# EAGLE design RemoteControl (EAGLE 9.6.2)
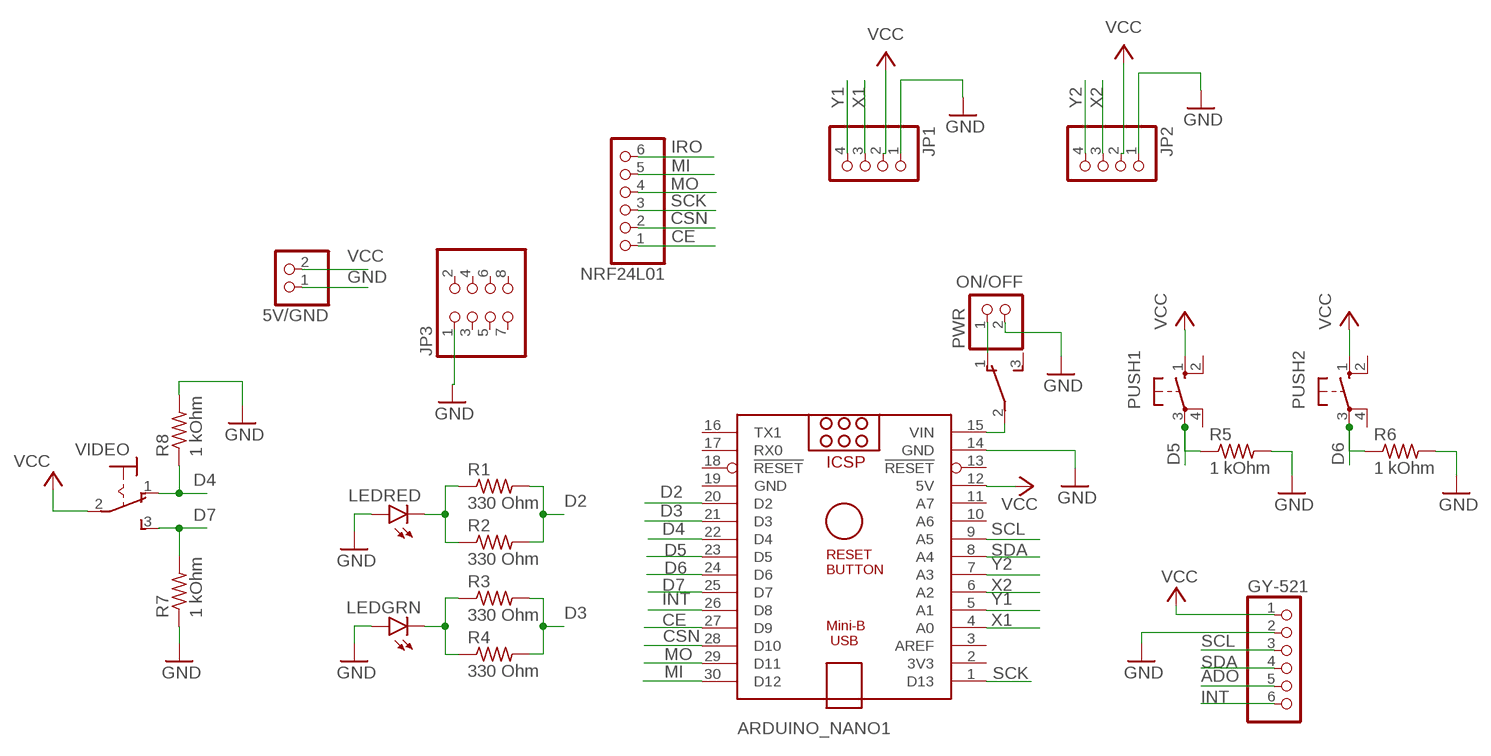
[diagram p0: schematic, sheet 1]

## Parts
5V/GND  PINHD-1X2  [1X02]
ARDUINO_NANO1  ARDUINO_NANO  [ARDUINO_NANO]
GY-521  PINHD-1X6  [1X06]
JP1  PINHD-1X4  [1X04]
JP2  PINHD-1X4  [1X04]
JP3  PINHD-2X4  [2X04]
LEDGRN  LED5MM  [LED5MM]
LEDRED  LED5MM  [LED5MM]
NRF24L01  PINHD-1X6  [1X06]
ON/OFF  TL36WO  [TL3XWO]
PUSH1  10-XX  [B3F-10XX]
PUSH2  10-XX  [B3F-10XX]
PWR  PINHD-1X2  [1X02]
R1  330 Ohm  R-US_0204/7  [0204/7]
R2  330 Ohm  R-US_0204/7  [0204/7]
R3  330 Ohm  R-US_0204/7  [0204/7]
R4  330 Ohm  R-US_0204/7  [0204/7]
R5  1 kOhm  R-US_0204/7  [0204/7]
R6  1 kOhm  R-US_0204/7  [0204/7]
R7  1 kOhm  R-US_0204/7  [0204/7]
R8  1 kOhm  R-US_0204/7  [0204/7]
VIDEO  320-916  [320-916]

## Nets
ADO: GY-521.5
CE: ARDUINO_NANO1.27(D9) NRF24L01.1
CSN: ARDUINO_NANO1.28(D10) NRF24L01.2
D2: ARDUINO_NANO1.20(D2) R1.2 R2.2
D3: ARDUINO_NANO1.21(D3) R3.2 R4.2
D4: ARDUINO_NANO1.22(D4) R8.1 VIDEO.1(O)
D5: ARDUINO_NANO1.23(D5) PUSH1.3(P) R5.1
D6: ARDUINO_NANO1.24(D6) PUSH2.3(P) R6.1
D7: ARDUINO_NANO1.25(D7) R7.2 VIDEO.3(S)
GND: 5V/GND.1 ARDUINO_NANO1.14(GND) GY-521.2 JP1.1 JP2.1 JP3.1 LEDGRN.A LEDRED.A PWR.2 R5.2 R6.2 R7.1 R8.2
INT: ARDUINO_NANO1.26(D8) GY-521.6
IRO: NRF24L01.6
MI: ARDUINO_NANO1.30(D12) NRF24L01.5
MO: ARDUINO_NANO1.29(D11) NRF24L01.4
N$1: ARDUINO_NANO1.15(VIN) ON/OFF.2(P)
N$2: ON/OFF.1(O) PWR.1
N$3: LEDRED.K(C) R1.1 R2.1
N$5: LEDGRN.K(C) R3.1 R4.1
SCK: ARDUINO_NANO1.1(D13) NRF24L01.3
SCL: ARDUINO_NANO1.9(A5) GY-521.3
SDA: ARDUINO_NANO1.8(A4) GY-521.4
VCC: 5V/GND.2 ARDUINO_NANO1.12(5V) GY-521.1 JP1.2 JP2.2 PUSH1.1(S) PUSH2.1(S) VIDEO.2(P)
X1: ARDUINO_NANO1.4(A0) JP1.3
X2: ARDUINO_NANO1.6(A2) JP2.3
Y1: ARDUINO_NANO1.5(A1) JP1.4
Y2: ARDUINO_NANO1.7(A3) JP2.4
Unconnected: ARDUINO_NANO1.2(3V3) ARDUINO_NANO1.3(AREF) ARDUINO_NANO1.10(A6) ARDUINO_NANO1.11(A7) ARDUINO_NANO1.13(!RESET) ARDUINO_NANO1.16(TX1) ARDUINO_NANO1.17(RX0) ARDUINO_NANO1.18(!RESET) JP3.2 JP3.3 JP3.4 JP3.5 JP3.6 JP3.7 JP3.8 ON/OFF.3(S) PUSH1.2(S1) PUSH1.4(P1) PUSH2.2(S1) PUSH2.4(P1)

## Power pins joined to a net without a drawn wire
GND: ARDUINO_NANO1.19(GND)

## Library data of the parts
5V/GND PWR = pinhead:PINHD-1X2: PIN HEADER
ARDUINO_NANO1 = ArduinoNanoV30:ARDUINO_NANO: Arduino Nano V3.0 Overview: The Arduino Nano is a small, complete, and breadboard-friendly board based on the ATmega328 (Arduino Nano 3.x) or ATmega168 (Arduino Nano 2.x). It has more or less the same functionality of the Arduino Duemilanove, but in a different package. It lacks only a DC power jack, and works with a Mini-B USB cable instead of a standard one. The Nano was designed and is being produced by Gravitech. Specifications: Microcontroller Atmel ATmega168 or ATmega328 Operating Voltage (logic level) 5 V Input Voltage (recommended) 7-12 V Input Voltage (limits) 6-20 V Digital I/O Pins 14 (of which 6 provide PWM output) Analog Input Pins 8 DC Current per I/O Pin 40 mA Flash Memory 16 KB (ATmega168) or 32 KB (ATmega328) of which 2 KB used by bootloader SRAM 1 KB (ATmega168) or 2 KB (ATmega328) EEPROM 512 bytes (ATmega168) or 1 KB (ATmega328) Clock Speed 16 MHz Dimensions 0.73" x 1.70" Length 45 mm Width 18 mm Weigth 5 g Power: The Arduino Nano can be powered via the Mini-B USB connection, 6-20V unregulated external power supply (pin 30), or 5V regulated external power supply (pin 27). The power source is automatically selected to the highest voltage source. Memory: The ATmega168 has 16 KB of flash memory for storing code (of which 2 KB is used for the bootloader); the ATmega328 has 32 KB, (also with 2 KB used for the bootloader). The ATmega168 has 1 KB of SRAM and 512 bytes of EEPROM (which can be read and written with the EEPROM library); the ATmega328 has 2 KB of SRAM and 1 KB of EEPROM. Input and Output: Each of the 14 digital pins on the Nano can be used as an input or output, using pinMode(), digitalWrite(), and digitalRead() functions. They operate at 5 volts. Each pin can provide or receive a maximum of 40 mA and has an internal pull-up resistor (disconnected by default) of 20-50 kOhms. In addition, some pins have specialized functions. Visit Arduino - ArduinoBoardNano <https://www.arduino.cc/en/Main/ArduinoBoardNano>
GY-521 NRF24L01 = pinhead:PINHD-1X6: PIN HEADER
JP1 JP2 = pinhead:PINHD-1X4: PIN HEADER
JP3 = pinhead:PINHD-2X4: PIN HEADER
LEDGRN LEDRED = led:LED: LED OSRAM: - CHIPLED LG R971, LG N971, LY N971, LG Q971, LY Q971, LO R971, LY R971 LH N974, LH R974 LS Q976, LO Q976, LY Q976 LO Q996 - Hyper CHIPLED LW Q18S LB Q993, LB Q99A, LB R99A - SideLED LS A670, LO A670, LY A670, LG A670, LP A670 LB A673, LV A673, LT A673, LW A673 LH A674 LY A675 LS A676, LA A676, LO A676, LY A676, LW A676 LS A679, LY A679, LG A679 - Hyper Micro SIDELED® LS Y876, LA Y876, LO Y876, LY Y876 LT Y87S - SmartLED LW L88C, LW L88S LB L89C, LB L89S, LG L890 LS L89K, LO L89K, LY L89K LS L896, LA L896, LO L896, LY L896 - TOPLED LS T670, LO T670, LY T670, LG T670, LP T670 LSG T670, LSP T670, LSY T670, LOP T670, LYG T670 LG T671, LOG T671, LSG T671 LB T673, LV T673, LT T673, LW T673 LH T674 LS T676, LA T676, LO T676, LY T676, LB T676, LH T676, LSB T676, LW T676 LB T67C, LV T67C, LT T67C, LS T67K, LO T67K, LY T67K, LW E67C LS E67B, LA E67B, LO E67B, LY E67B, LB E67C, LV E67C, LT E67C LW T67C LS T679, LY T679, LG T679 LS T770, LO T770, LY T770, LG T770, LP T770 LB T773, LV T773, LT T773, LW T773 LH T774 LS E675, LA E675, LY E675, LS T675 LS T776, LA T776, LO T776, LY T776, LB T776 LHGB T686 LT T68C, LB T68C - Hyper Mini TOPLED® LB M676 - Mini TOPLED Santana® LG M470 LS M47K, LO M47K, LY M47K Source: http://www.osram.convergy.de LUXEON: - LUMILED® LXK2-PW12-R00, LXK2-PW12-S00, LXK2-PW14-U00, LXK2-PW14-V00 LXK2-PM12-R00, LXK2-PM12-S00, LXK2-PM14-U00 LXK2-PE12-Q00, LXK2-PE12-R00, LXK2-PE12-S00, LXK2-PE14-T00, LXK2-PE14-U00 LXK2-PB12-K00, LXK2-PB12-L00, LXK2-PB12-M00, LXK2-PB14-N00, LXK2-PB14-P00, LXK2-PB14-Q00 LXK2-PR12-L00, LXK2-PR12-M00, LXK2-PR14-Q00, LXK2-PR14-R00 LXK2-PD12-Q00, LXK2-PD12-R00, LXK2-PD12-S00 LXK2-PH12-R00, LXK2-PH12-S00 LXK2-PL12-P00, LXK2-PL12-Q00, LXK2-PL12-R00 Source: www.luxeon.com KINGBRIGHT: KA-3528ASYC Source: www.kingbright.com
ON/OFF = switch_TL3XWO:TL36WO: TINY SWITCH ON - ON Source: http://www2.produktinfo.conrad.com/datenblaetter/700000-724999/705152-da-01-de-Subminiaturschalter_TL_36WO.pdf
PUSH1 PUSH2 = switch-omron:10-XX: OMRON SWITCH; MPN: B3F-1000; OC_FARNELL: 176432; OC_NEWARK: 36M3542
R1-R8 = rcl:R-US_: RESISTOR, American symbol; SPICEPREFIX: R
VIDEO = switch:320-916: TOGGLE SWITCH distributor RS Components

## Board
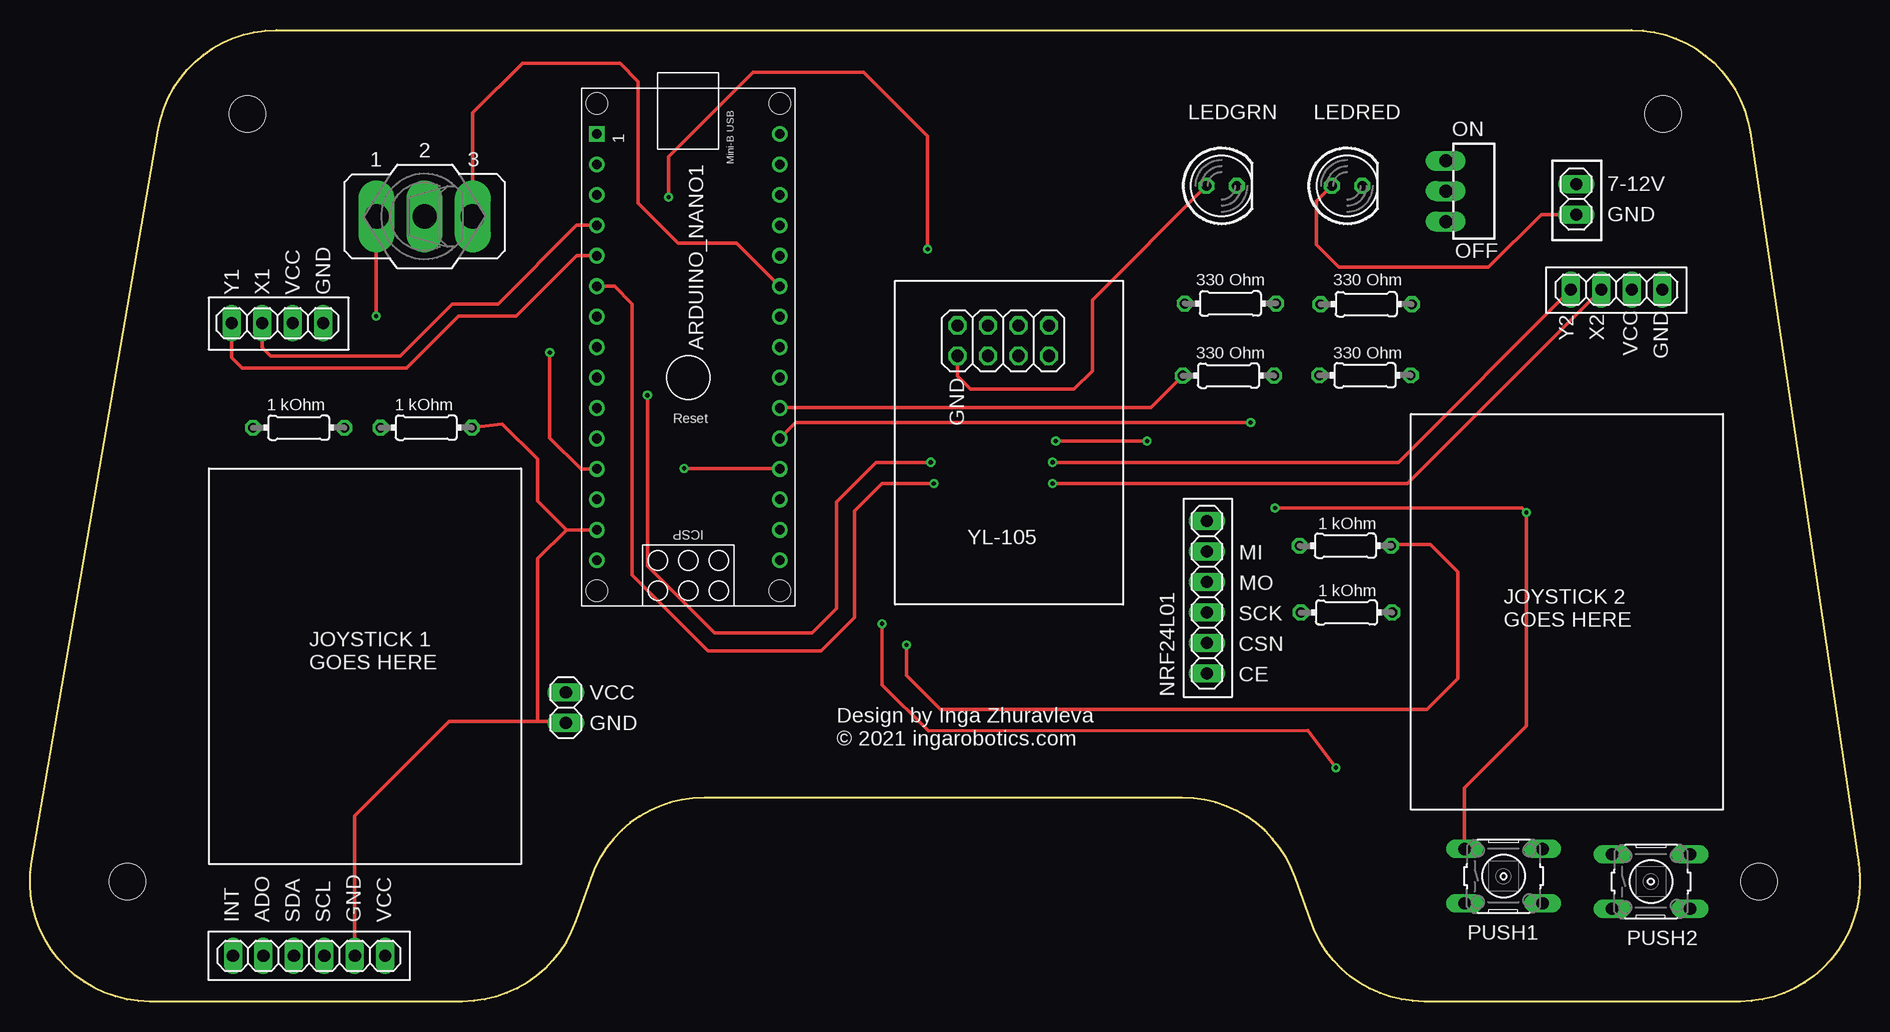
[diagram p1: board, top side]
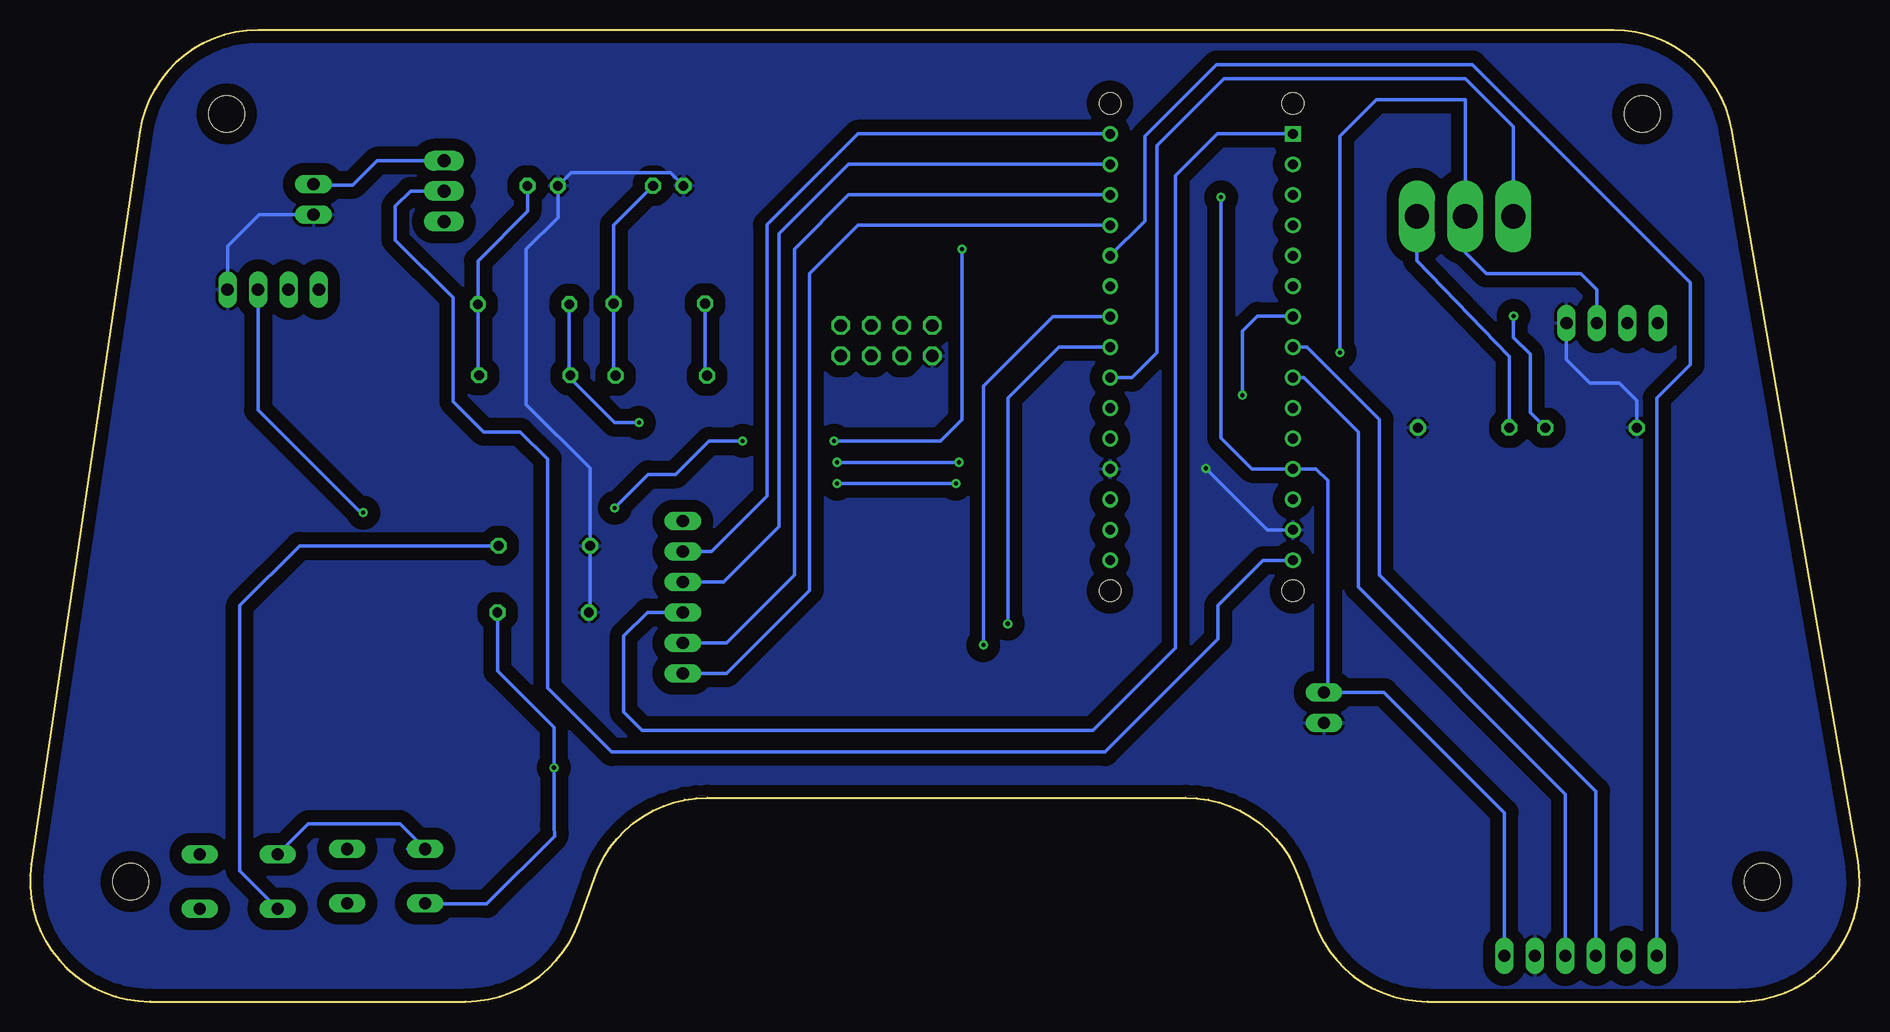
[diagram p2: board, bottom side, seen from below]

Size 152.52 x 81 mm. Coordinates in mm from the lower left corner, seen from the top.
Outline: 0.14,11.7 10.69,72.7 arc-80 20.54,81 133.49,81 arc-82 143.38,72.47 152.42,11.46 arc-98 142.53,0 116.2,0 arc-71 106.77,6.67 105.48,10.33 arc71 96.05,17 56.2,17 arc71 46.77,10.33 45.48,6.67 arc-71 36.05,0 10,0 arc-100 0.14,11.7
Copper layers (1*16): Top 0.035mm / dielectric 1.5mm / Bottom 0.035mm
Design rules "default": minimum track width 6mil, minimum drill 0.35mm, track to track 6mil, track to pad 6mil, pad to pad 6mil, via to via 6mil, smd to smd 6mil, copper to edge 40mil, drill to drill 6mil, minimum pad ring 10mil, minimum via ring 8mil, stop-mask expansion 4mil, vias tented up to drill 0mil, thermal gap 10mil
Holes 3 mm at 18.12,74 136.12,74 8.12,10 144.12,10

### Footprints (pad centres in the part's own frame; a part is rotated, then mirrored left to right if it is on the bottom)
1X02 = drill 1.016 long: 1 -1.27,0; 2 1.27,0
ARDUINO_NANO = drill 0.8 square: 1 -20.32,-7.62 | drill 0.8: 2 -17.78,-7.62; 3 -15.24,-7.62; 4 -12.7,-7.62; 5 -10.16,-7.62; 6 -7.62,-7.62; 7 -5.08,-7.62; 8 -2.54,-7.62; 9 0,-7.62; 10 2.54,-7.62; 11 5.08,-7.62; 12 7.62,-7.62; 13 10.16,-7.62; 14 12.7,-7.62; 15 15.24,-7.62; 16 15.24,7.62; 17 12.7,7.62; 18 10.16,7.62; 19 7.62,7.62; 20 5.08,7.62; 21 2.54,7.62; 22 0,7.62; 23 -2.54,7.62; 24 -5.08,7.62; 25 -7.62,7.62; 26 -10.16,7.62; 27 -12.7,7.62; 28 -15.24,7.62; 29 -17.78,7.62; 30 -20.32,7.62 | hole 1.778: -22.86,-7.62; -22.86,7.62; 17.78,7.62; 17.78,-7.62
1X06 = drill 1.016 long: 1 -6.35,0; 2 -3.81,0; 3 -1.27,0; 4 1.27,0; 5 3.81,0; 6 6.35,0
1X04 = drill 1.016 long: 1 -3.81,0; 2 -1.27,0; 3 1.27,0; 4 3.81,0
2X04 = drill 1.016 octagon: 1 -3.81,-1.27; 2 -3.81,1.27; 3 -1.27,-1.27; 4 -1.27,1.27; 5 1.27,-1.27; 6 1.27,1.27; 7 3.81,-1.27; 8 3.81,1.27
LED5MM = drill 0.813 octagon: A -1.27,0; K 1.27,0
TL3XWO = drill 1.1 pad 1.422 long: 1 -2.54,-5.08; 2 0,-5.08; 3 2.54,-5.08
B3F-10XX = drill 1.016 long: 1 -3.251,2.261; 2 3.251,2.261; 3 -3.251,-2.261; 4 3.251,-2.261
0204/7 = drill 0.813 octagon: 1 -3.81,0; 2 3.81,0
320-916 = drill 2.007 long: 1 0,4.013; 2 0,0; 3 0,-4.013

### Placement (x,y rotation side)
5V/GND  44.66,24.51 90 top
ARDUINO_NANO1  54.87,52.02 270 top
GY-521  23.27,3.81 180 top
JP1  20.63,56.55 180 top
JP2  132.25,59.35 180 top
JP3  81.12,55.1 0 top
LEDGRN  99.32,68.01 0 top
LEDRED  109.78,68.01 0 top
NRF24L01  98.1,33.71 90 top
ON/OFF  123.09,67.56 270 top
PUSH1  122.83,10.45 0 top
PUSH2  135.12,10 0 top
PWR  128.89,66.88 270 top
R1  111.38,58.13 180 top
R2  111.28,52.21 180 top
R3  99.9,52.18 180 top
R4  100.06,58.2 180 top
R5  109.74,32.44 180 top
R6  109.64,38 180 top
R7  33.02,47.84 180 top
R8  22.4,47.84 180 top
VIDEO  32.89,65.46 90 top

### Tracks (layer width: path | path; a pad name or v marks a point on that pad's centre or on a via)
CE
  Bottom 0.305: ARDUINO_NANO1.27 83.51,64.72 87.53,60.71 87.53,34.29 94.45,27.36 NRF24L01.1
CSN
  Bottom 0.305: ARDUINO_NANO1.28 84.28,67.26 88.8,62.74 88.8,35.56 94.45,29.9 NRF24L01.2
D2  (via drill 0.35)
  Top 0.305: ARDUINO_NANO1.20 63.81,48.26 v101.75,48.26
  Bottom 0.305: R1.2 107.57,52.31 R2.2 107.47,51.96 103.77,48.26 v101.75,48.26
D3
  Top 0.305: R3.2 93.44,49.53 62.79,49.53 62.74,49.48 ARDUINO_NANO1.21
  Bottom 0.305: R4.2 96.25,52.34 R3.2
D4  (via drill 0.35)
  Top 0.305: v28.85,57.15 28.85,65.43 VIDEO.1
  Bottom 0.305: VIDEO.1 28.88,72.92 32.89,76.94 53.01,76.94 58.57,71.37 58.57,54.1 60.65,52.02 ARDUINO_NANO1.22 | v28.85,57.15 28.85,55.37 27.48,54 27.48,49.11 R8.1
D5  (via drill 0.35)
  Top 0.305: v71.02,31.5 71.02,26.42 74.89,22.54 106.51,22.62 v108.85,19.49
  Bottom 0.305: ARDUINO_NANO1.23 66.75,54.56 71.02,50.29 v71.02,31.5 | R5.1 113.55,27.55 108.85,22.84 v108.85,19.49 108.85,14.69 108.8,13.78 114.45,8.13 119.52,8.13 PUSH1.3
D6  (via drill 0.35)
  Top 0.305: v73.05,29.72 73.05,27.18 75.89,24.34 116.44,24.34 119.02,26.92 119.02,35.81 116.74,38.1 113.55,38.1 R6.1
  Bottom 0.305: PUSH2.3 135.03,10.9 135.03,33.02 130.05,38 R6.1 | ARDUINO_NANO1.24 67.26,57.1 73.05,51.31 v73.05,29.72
D7
  Top 0.305: ARDUINO_NANO1.25 58.88,63.25 54,63.25 50.7,66.55 50.7,76.71 49.17,78.23 41.05,78.23 36.91,74.09 VIDEO.3
  Bottom 0.305: 36.83,65.39 VIDEO.3 36.91,61.78 29.21,53.76 R7.2
GND  (via drill 0.35)
  Top 0.305: R7.1 39.37,48.15 42.32,45.21 42.32,41.71 44.71,39.32 | 44.71,39.32 ARDUINO_NANO1.14 | LEDGRN.A 88.54,58.5 88.54,52.58 87.02,51.05 78.38,51.05 77.31,52.13 JP3.1 | GY-521.2 27.08,15.49 34.95,23.37 42.32,23.37 | 42.32,23.37 44.53,23.37 5V/GND.1 | 44.71,39.32 42.32,36.93 42.32,23.37 | PWR.2 125.96,65.61 121.56,61.21 109.12,61.21 107.24,63.09 107.24,66.74 LEDRED.A | v54.51,44.45 62.44,44.45 ARDUINO_NANO1.19
  Bottom 0.305: LEDGRN.A 99.13,69.09 107.43,69.09 LEDRED.A 108.51,65.37 111.15,62.74 111.15,49.78 105.83,44.47 R6.2 105.83,32.54 R5.2 | R8.2 18.59,50.12 20.03,51.56 22.5,51.56 24.44,53.5 JP1.1 | PWR.2 133.42,65.61 136.06,62.98 JP2.1 | ARDUINO_NANO1.14 49.38,39.32 v54.51,44.45
  pour Bottom (isolate 1.016): -8.23,84.84 160.93,84.84 160.93,-3.56 -8.23,-3.56
INT
  Bottom 0.305: ARDUINO_NANO1.26 59.59,65.08 59.59,72.14 53.62,78.11 32.28,78.11 14.12,59.94 14.12,53.09 16.92,50.29 GY-521.6
MI
  Bottom 0.305: ARDUINO_NANO1.30 83.51,72.34 91.08,64.77 91.08,42.16 95.72,37.52 NRF24L01.5
MO
  Bottom 0.305: ARDUINO_NANO1.29 84.28,69.8 90.07,64.01 90.07,39.62 94.71,34.98 NRF24L01.4
N$1
  Bottom 0.305: ARDUINO_NANO1.15 49.73,36.78 53.49,33.02 53.49,30.23 62.91,20.81 104.02,20.81 109.37,26.16 109.37,45.21 111.66,47.5 114.71,47.5 117.25,50.04 117.25,58.67 122.07,63.5 122.07,66.29 120.8,67.56 ON/OFF.2
N$2
  Bottom 0.305: ON/OFF.1 123.6,70.1 125.63,68.07 128.81,68.07 PWR.1
N$3
  Bottom 0.305: R2.1 115.19,52.31 R1.1 115.19,61.75 111.05,65.88 LEDRED.K
N$5
  Bottom 0.305: LEDGRN.K 103.87,64.73 R4.1 103.87,52.34 R3.1
SCK
  Bottom 0.305: ARDUINO_NANO1.1 53.54,72.34 57.05,68.83 57.05,29.46 63.91,22.61 101.5,22.61 103.02,24.13 103.02,30.48 101.06,32.44 NRF24L01.3
SCL
  Bottom 0.305: ARDUINO_NANO1.9 46.33,52.02 41.81,47.5 41.81,34.54 24.54,17.27 GY-521.3
SDA
  Bottom 0.305: ARDUINO_NANO1.8 46.08,54.56 40.03,48.51 40.03,35.56 22,17.53 GY-521.4
VCC  (via drill 0.35)
  Top 0.305: v43.33,54.1 43.33,46.99 45.92,44.4 ARDUINO_NANO1.12 | v74.83,62.74 74.83,72.14 69.49,77.47 60.26,77.47 53.24,70.45 v53.24,67.06 | PUSH1.1 119.58,17.83 124.74,22.99 v124.74,40.77 124.36,41.15 v103.78,41.15 | v93.12,46.74 v85.5,46.74
  Bottom 0.305: PUSH2.1 129.33,14.8 121.67,14.8 PUSH1.1 121.05,12.71 | v43.33,54.1 43.33,72.14 40.28,75.18 32.89,75.18 VIDEO.2 32.89,62.46 31.14,60.71 23.27,60.71 21.9,59.34 JP1.2 | JP2.2 133.52,49.32 124.96,40.77 v124.74,40.77 | v103.78,41.15 100.99,43.94 98.7,43.94 95.91,46.74 v93.12,46.74 | GY-521.1 29.62,15.75 39.65,25.78 5V/GND.2 44.35,26.09 44.35,43.43 45.31,44.4 ARDUINO_NANO1.12 50.65,44.4 53.24,46.99 v53.24,67.06 | v85.5,46.74 76.61,46.74 74.83,48.51 v74.83,62.74
X1
  Top 0.305: JP1.3 19.36,54.52 20.07,53.82 30.86,53.82 35.2,58.17 39.01,58.17 45.57,64.72 ARDUINO_NANO1.4
X2  (via drill 0.35)
  Top 0.305: JP2.3 114.81,43.18 v85.24,43.18 | v75.34,43.18 71.02,43.18 68.73,40.89 68.73,32 65.94,29.21 56.54,29.21 50.19,35.56 50.19,58.17 48.72,59.64 ARDUINO_NANO1.6
  Bottom 0.305: v85.24,43.18 v75.34,43.18
Y1
  Top 0.305: JP1.4 16.82,53.69 17.68,52.83 31.39,52.83 35.71,57.15 40.54,57.15 45.57,62.18 ARDUINO_NANO1.5
Y2  (via drill 0.35)
  Top 0.305: JP2.4 114.05,44.96 v85.24,44.96 | v75.08,44.96 70.51,44.96 67.21,41.66 67.21,32.77 65.18,30.73 57.05,30.73 51.46,36.32 v51.46,50.55
  Bottom 0.305: v85.24,44.96 v75.08,44.96 | ARDUINO_NANO1.7 47.3,57.15 50.19,57.15 51.46,55.88 v51.46,50.55

### Text on the board
tPlace: 1 | 2 | 3 | 7-12V | GND | Y2 | X2 | VCC | GND | YL-105 | JOYSTICK 2 / GOES HERE | JOYSTICK 1 / GOES HERE | Design by Inga Zhuravleva / © 2021 ingarobotics.com | VCC
tNames: ON | OFF | 330 Ohm | 330 Ohm | Y1 | X1 | VCC | GND | 330 Ohm | 330 Ohm | 1 kOhm | 1 kOhm | GND | 1 kOhm | MI | MO | 1 kOhm | SCK | CSN | CE | VCC | NRF24L01 | GND | INT | ADO | SDA | SCL | GND